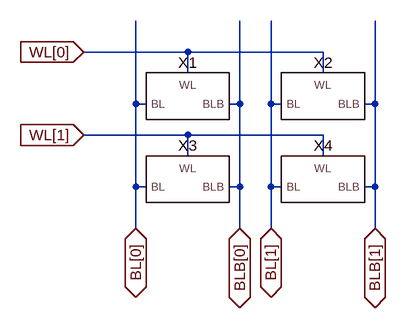
[diagram p0: schematic MCBM2.asc]
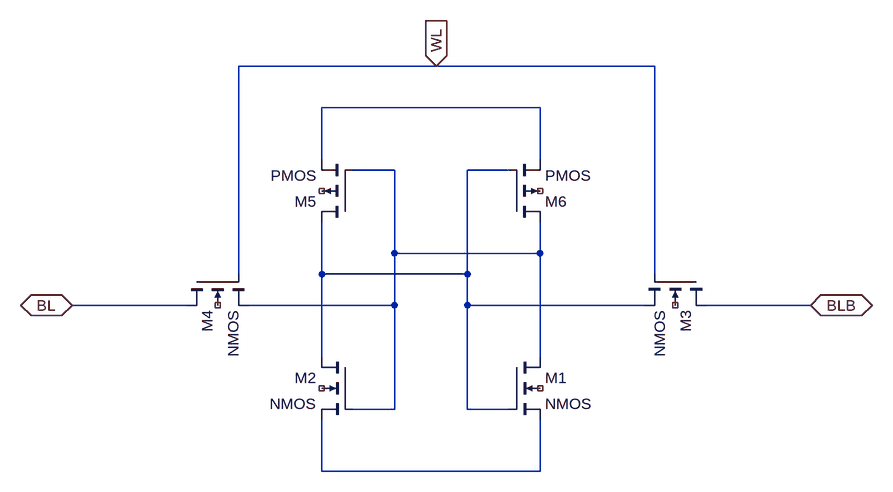
[diagram p1: sub-circuit mcb.asc]
MCBM2.asc, the LTspice schematic file:
Version 4
SHEET 1 880 680
WIRE 112 80 -48 80
WIRE 320 80 112 80
WIRE 112 112 112 80
WIRE 320 112 320 80
WIRE 32 160 32 32
WIRE 48 160 32 160
WIRE 192 160 192 32
WIRE 192 160 176 160
WIRE 240 160 240 32
WIRE 256 160 240 160
WIRE 400 160 400 32
WIRE 400 160 384 160
WIRE 112 208 -48 208
WIRE 320 208 112 208
WIRE 112 240 112 208
WIRE 320 240 320 208
WIRE 32 288 32 160
WIRE 48 288 32 288
WIRE 192 288 192 160
WIRE 192 288 176 288
WIRE 240 288 240 160
WIRE 256 288 240 288
WIRE 400 288 400 160
WIRE 400 288 384 288
WIRE 32 352 32 288
WIRE 192 352 192 288
WIRE 240 352 240 288
WIRE 400 352 400 288
FLAG 32 352 BL[0]
IOPIN 32 352 BiDir
FLAG 240 352 BL[1]
IOPIN 240 352 BiDir
FLAG 192 352 BLB[0]
IOPIN 192 352 BiDir
FLAG 400 352 BLB[1]
IOPIN 400 352 BiDir
FLAG -48 80 WL[0]
IOPIN -48 80 In
FLAG -48 208 WL[1]
IOPIN -48 208 In
SYMBOL MCB 112 144 R0
SYMATTR InstName X1
SYMBOL MCB 320 144 R0
SYMATTR InstName X2
SYMBOL MCB 112 272 R0
SYMATTR InstName X3
SYMBOL MCB 320 272 R0
SYMATTR InstName X4

mcb.asc, the sub-circuit schematic file:
Version 4
SHEET 1 880 680
WIRE 96 -272 -208 -272
WIRE 432 -272 96 -272
WIRE 256 -208 -80 -208
WIRE -80 -128 -80 -208
WIRE 256 -128 256 -208
WIRE 32 -112 -32 -112
WIRE 208 -112 144 -112
WIRE 32 16 32 -112
WIRE 256 16 256 -32
WIRE 256 16 32 16
WIRE -208 48 -208 -272
WIRE -80 48 -80 -32
WIRE 144 48 144 -112
WIRE 144 48 -80 48
WIRE 432 48 432 -272
WIRE -288 96 -464 96
WIRE 32 96 32 16
WIRE 32 96 -192 96
WIRE 144 96 144 48
WIRE 416 96 144 96
WIRE 672 96 512 96
WIRE -80 176 -80 48
WIRE 256 176 256 16
WIRE 32 256 32 96
WIRE 32 256 -32 256
WIRE 144 256 144 96
WIRE 208 256 144 256
WIRE -80 352 -80 272
WIRE 256 352 256 272
WIRE 256 352 -80 352
FLAG -464 96 BL
IOPIN -464 96 BiDir
FLAG 672 96 BLB
IOPIN 672 96 BiDir
FLAG 96 -272 WL
IOPIN 96 -272 In
SYMBOL nmos4 208 176 R0
SYMATTR InstName M1
SYMBOL nmos4 -32 176 M0
SYMATTR InstName M2
SYMBOL nmos4 512 48 R90
SYMATTR InstName M3
SYMBOL nmos4 -288 48 M90
SYMATTR InstName M4
SYMBOL pmos4 -32 -32 R180
SYMATTR InstName M5
SYMBOL pmos4 208 -32 M180
SYMATTR InstName M6

The netlist it stands for:
* MCBM2.asc
XX1 WL[0] BL[0] BLB[0] mcb
XX2 WL[0] BL[1] BLB[1] mcb
XX3 WL[1] BL[0] BLB[0] mcb
XX4 WL[1] BL[1] BLB[1] mcb

* block symbol definitions
.subckt mcb WL BL BLB
M1 N002 N003 N004 NC_01 NMOS
M2 N003 N002 N004 NC_02 NMOS
M3 BLB WL N003 NC_03 NMOS
M4 BL WL N002 NC_04 NMOS
M5 N003 N002 N001 NC_05 PMOS
M6 N002 N003 N001 NC_06 PMOS
.ends mcb

.model NMOS NMOS
.model PMOS PMOS
.lib standard.mos
.backanno
.end